# Altium schematic sheet Power Supply Section.SchDoc
size A3; SheetNumber: 2; SheetTotal: 7
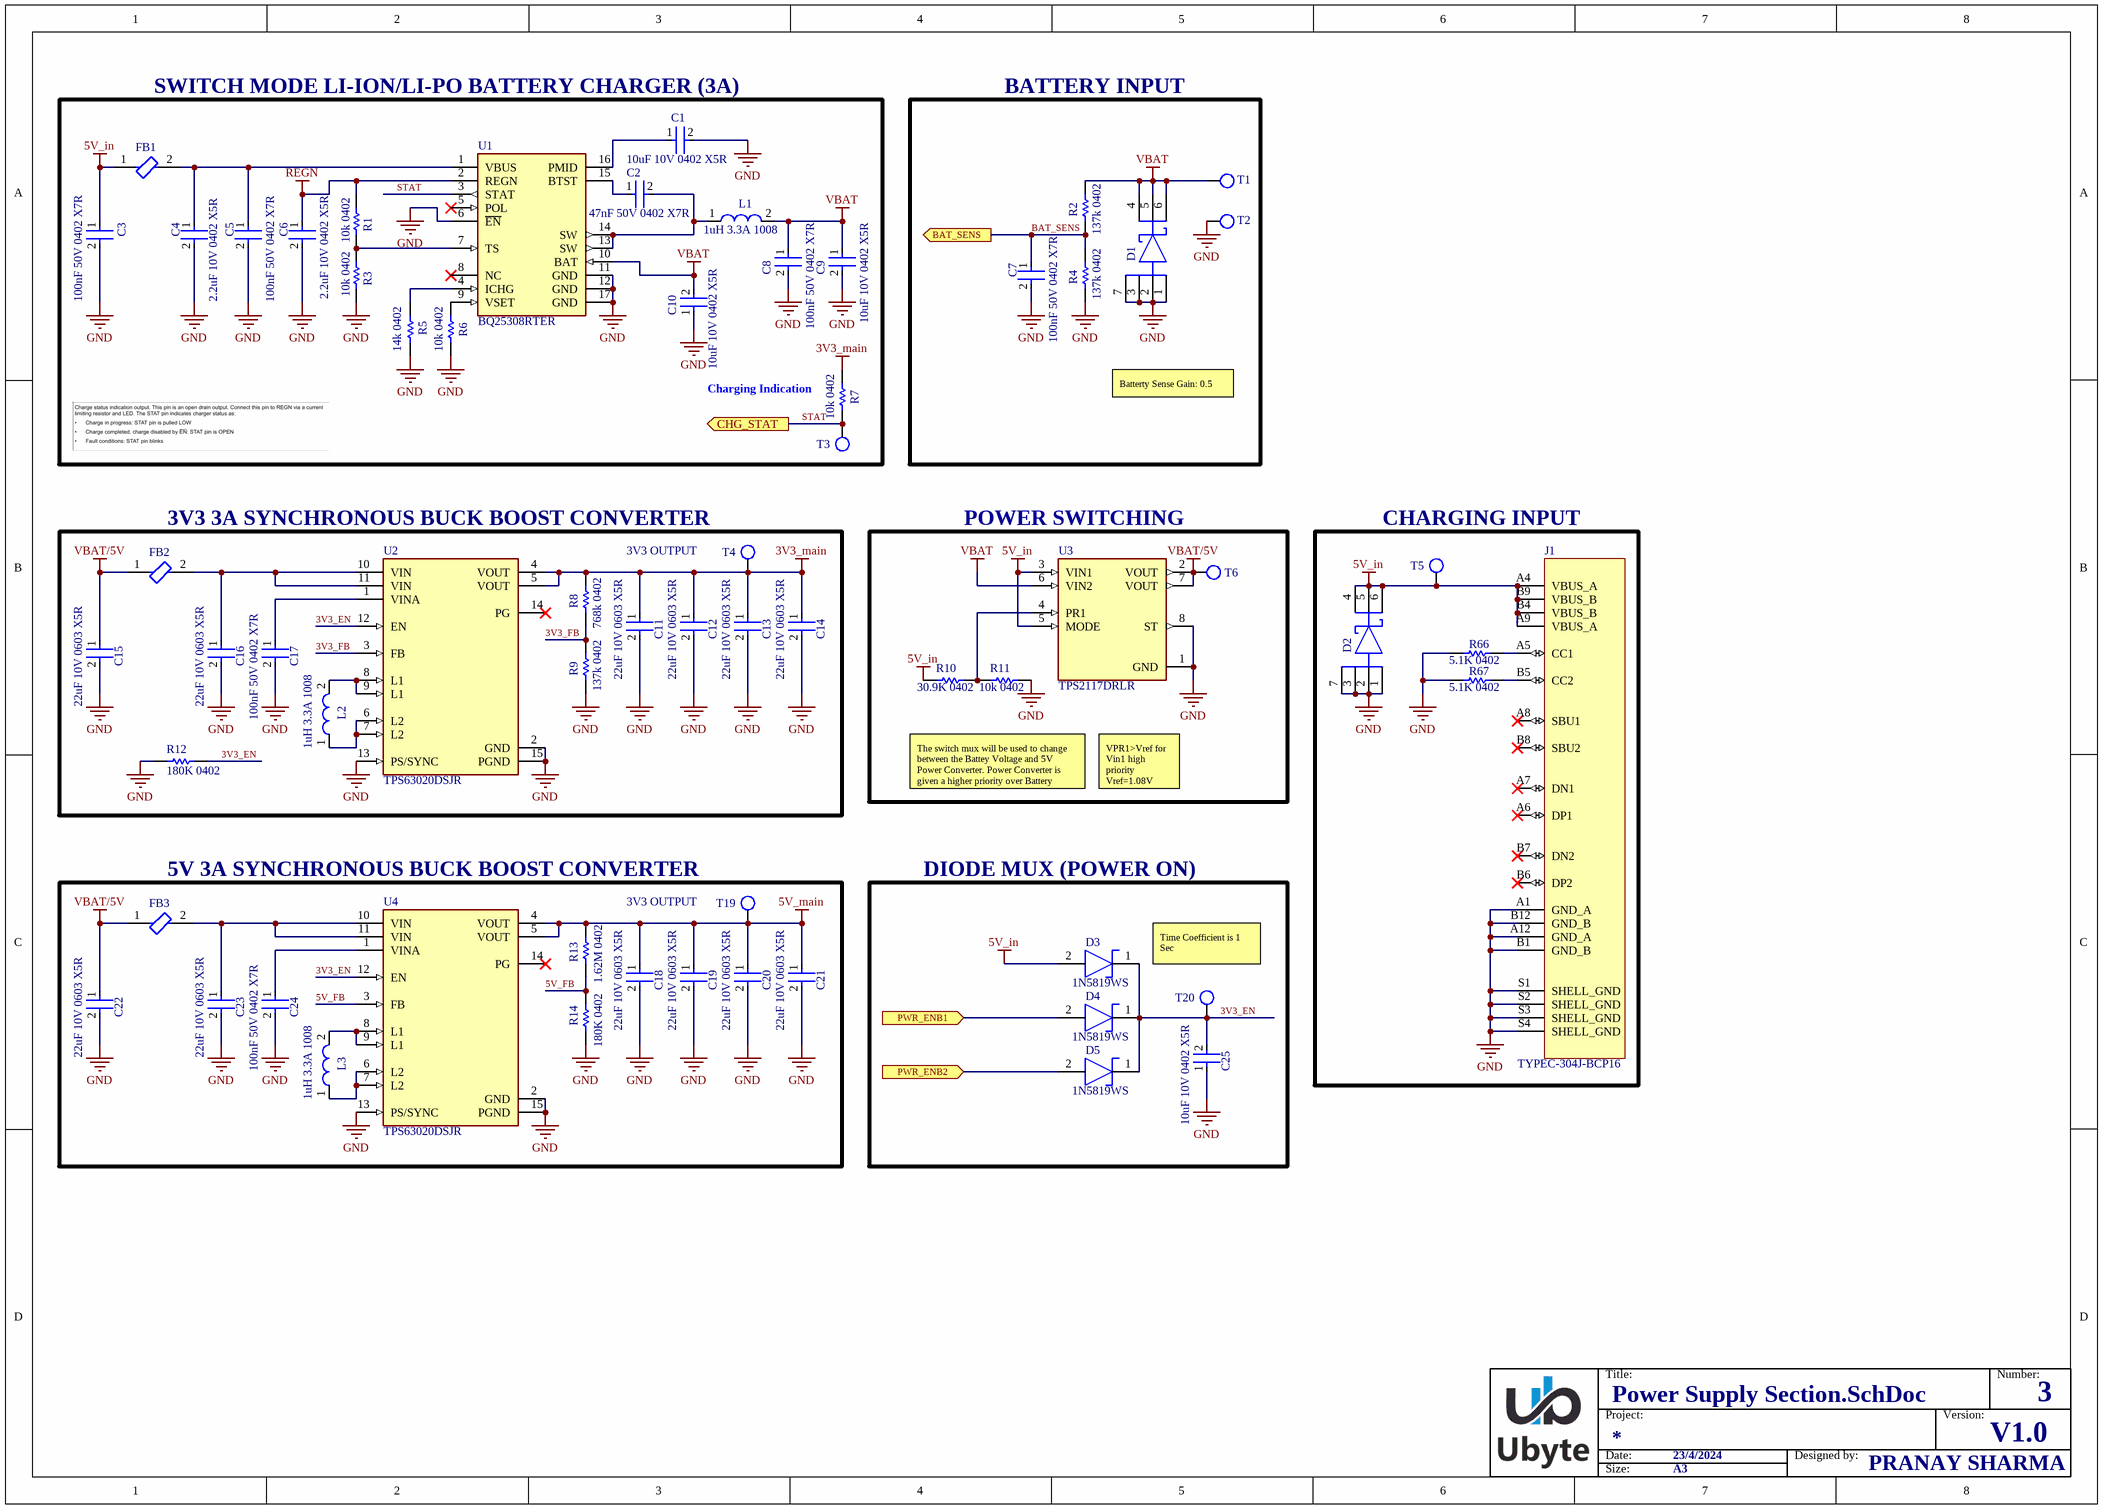
[diagram p0: Power Supply Section.SchDoc]

## Parts
C1  10uF 10V 0402 X5R  [0402 IPC CLASS C CAPACITOR]
C2  47nF 50V 0402 X7R  [0402 IPC CLASS C CAPACITOR]
C3  100nF 50V 0402 X7R  [0402 IPC CLASS C CAPACITOR]
C4  2.2uF 10V 0402 X5R  [0402 IPC CLASS C CAPACITOR]
C5  100nF 50V 0402 X7R  [0402 IPC CLASS C CAPACITOR]
C6  2.2uF 10V 0402 X5R  [0402 IPC CLASS C CAPACITOR]
C7  100nF 50V 0402 X7R  [0402 IPC CLASS C CAPACITOR]
C8  100nF 50V 0402 X7R  [0402 IPC CLASS C CAPACITOR]
C9  10uF 10V 0402 X5R  [0402 IPC CLASS C CAPACITOR]
C10  10uF 10V 0402 X5R  [0402 IPC CLASS C CAPACITOR]
C11  22uF 10V 0603 X5R  [0603 IPC CLASS C CAPACITOR]
C12  22uF 10V 0603 X5R  [0603 IPC CLASS C CAPACITOR]
C13  22uF 10V 0603 X5R  [0603 IPC CLASS C CAPACITOR]
C14  22uF 10V 0603 X5R  [0603 IPC CLASS C CAPACITOR]
C15  22uF 10V 0603 X5R  [0603 IPC CLASS C CAPACITOR]
C16  22uF 10V 0603 X5R  [0603 IPC CLASS C CAPACITOR]
C17  100nF 50V 0402 X7R  [0402 IPC CLASS C CAPACITOR]
C18  22uF 10V 0603 X5R  [0603 IPC CLASS C CAPACITOR]
C19  22uF 10V 0603 X5R  [0603 IPC CLASS C CAPACITOR]
C20  22uF 10V 0603 X5R  [0603 IPC CLASS C CAPACITOR]
C21  22uF 10V 0603 X5R  [0603 IPC CLASS C CAPACITOR]
C22  22uF 10V 0603 X5R  [0603 IPC CLASS C CAPACITOR]
C23  22uF 10V 0603 X5R  [0603 IPC CLASS C CAPACITOR]
C24  100nF 50V 0402 X7R  [0402 IPC CLASS C CAPACITOR]
C25  10uF 10V 0402 X5R  [0402 IPC CLASS C CAPACITOR]
D1  (no value)  [DRV0006A IPC-C]
D2  (no value)  [DRV0006A IPC-C]
D3  1N5819WS  [SOD-323 IPC-C]
D4  1N5819WS  [SOD-323 IPC-C]
D5  1N5819WS  [SOD-323 IPC-C]
FB1  BLM21SP111SN1D  [0603 IPC CLASS C FERRITE BEAD]  (value not drawn)
FB2  BLM21SP111SN1D  [0603 IPC CLASS C FERRITE BEAD]  (value not drawn)
FB3  BLM21SP111SN1D  [0603 IPC CLASS C FERRITE BEAD]  (value not drawn)
J1  TYPEC-304J-BCP16  [VALCON_CSP-USC16-TR]
L1  1uH 3.3A 1008  [1008 Inductor IPC-C]
L2  1uH 3.3A 1008  [1008 Inductor IPC-C]
L3  1uH 3.3A 1008  [1008 Inductor IPC-C]
R1  10k 0402  [0402 IPC CLASS C RESISTOR]
R2  137k 0402  [0402 IPC CLASS C RESISTOR]
R3  10k 0402  [0402 IPC CLASS C RESISTOR]
R4  137k 0402  [0402 IPC CLASS C RESISTOR]
R5  14k 0402  [0402 IPC CLASS C RESISTOR]
R6  10k 0402  [0402 IPC CLASS C RESISTOR]
R7  10k 0402  [0402 IPC CLASS C RESISTOR]
R8  768k 0402  [0402 IPC CLASS C RESISTOR]
R9  137k 0402  [0402 IPC CLASS C RESISTOR]
R10  30.9K 0402  [0402 IPC CLASS C RESISTOR]
R11  10k 0402  [0402 IPC CLASS C RESISTOR]
R12  180K 0402  [0402 IPC CLASS C RESISTOR]
R13  1.62M 0402  [0402 IPC CLASS C RESISTOR]
R14  180K 0402  [0402 IPC CLASS C RESISTOR]
R66  5.1K 0402  [0402 IPC CLASS C RESISTOR]
R67  5.1K 0402  [0402 IPC CLASS C RESISTOR]
T1  Test Point TH  [Test Point TH]  (value not drawn)  (no BOM)
T2  Test Point TH  [Test Point TH]  (value not drawn)  (no BOM)
T3  TP  [Testpoint1]  (value not drawn)  (no BOM)
T4  TP  [Testpoint1]  (value not drawn)  (no BOM)
T5  TP  [Testpoint1]  (value not drawn)  (no BOM)
T6  TP  [Testpoint1]  (value not drawn)  (no BOM)
T19  TP  [Testpoint1]  (value not drawn)  (no BOM)
T20  TP  [Testpoint1]  (value not drawn)  (no BOM)
U1  BQ25308RTER  [RTE0016C IPC-C]
U2  TPS63020DSJR  [FP-DSJ0014A-MFG]
U3  TPS2117DRLR  [DRL0008A IPC-C]
U4  TPS63020DSJR  [FP-DSJ0014A-MFG]

## Blocks framed on the sheet
SWITCH MODE LI-ION/LI-PO BATTERY CHARGER (3A): C1-C6 C8-C10 FB1 L1 R1 R3 R5-R7 T3 U1
BATTERY INPUT: C7 D1 R2 R4 T1 T2
3V3 3A SYNCHRONOUS BUCK BOOST CONVERTER: C11-C17 FB2 L2 R8 R9 R12 T4 U2
POWER SWITCHING: R10 R11 T6 U3
CHARGING INPUT: D2 J1 R66 R67 T5
5V 3A SYNCHRONOUS BUCK BOOST CONVERTER: C18-C24 FB3 L3 R13 R14 T19 U4
DIODE MUX (POWER ON): C25 D3-D5 T20

## Ports
BAT_SENS (out), CHG_STAT (out), PWR_ENB1 (in), PWR_ENB2 (in)

## Nets
3V3_main: C11.1 C12.1 C13.1 C14.1 R7.2 R8.1 T4.0 U2.4(VOUT) U2.5(VOUT)
5V_in: C3.1 D2.4 D2.5 D2.6 D3.2(A) FB1.1 J1.A4(VBUS_A) J1.A9(VBUS_A) J1.B4(VBUS_B) J1.B9(VBUS_B) R10.2 T5.0 U3.3(VIN1) U3.5(MODE)
5V_main: C18.1 C19.1 C20.1 C21.1 R13.2 T19.0 U4.4(VOUT) U4.5(VOUT)
GND: C1.2 C3.2 C4.2 C5.2 C6.2 C7.2 C8.2 C9.2 C10.1 C11.2 C12.2 C13.2 C14.2 C15.2 C16.2 C17.2 C18.2 C19.2 C20.2 C21.2 C22.2 C23.2 C24.2 C25.1 D1.1(C) D1.2(A) D1.3 D1.7 D2.1(C) D2.2(A) D2.3 D2.7 J1.A1(GND_A) J1.A12(GND_A) J1.B1(GND_B) J1.B12(GND_B) J1.S1(SHELL_GND) J1.S2(SHELL_GND) J1.S3(SHELL_GND) J1.S4(SHELL_GND) R3.1 R4.1 R5.1 R6.1 R9.1 R11.1 R12.2 R14.1 R66.1 R67.1 T2.0 U1.6(~{EN}) U1.11(GND) U1.12(GND) U1.17(GND) U2.2(GND) U2.13(PS/SYNC) U2.15(PGND) U3.1(GND) U3.8(ST) U4.2(GND) U4.13(PS/SYNC) U4.15(PGND)
REGN: C6.1 R1.2 U1.2(REGN)
VBAT: C8.1 C9.1 C10.2 D1.4 D1.5 D1.6 L1.2 R2.2 T1.0 U1.10(BAT) U3.6(VIN2)
VBAT/5V: C15.1 C22.1 FB2.1 FB3.1 T6.0 U3.2(VOUT) U3.7(VOUT)
3V3_EN: C25.2 D3.1(C) D4.1(C) D5.1(C) R12.1 T20.0 U2.12(EN) U4.12(EN)
3V3_FB: R8.2 R9.2 U2.3(FB)
5V_FB: R13.1 R14.2 U4.3(FB)
BAT_SENS: C7.1 R2.1 R4.2 ; port BAT_SENS
PWR_ENB1: D4.2(A) ; port PWR_ENB1
PWR_ENB2: D5.2(A) ; port PWR_ENB2
STAT: R7.1 T3.0 U1.3(STAT) ; port CHG_STAT
NetC1_1: C1.1 U1.16(PMID)
NetC2_1: C2.1 U1.15(BTST)
NetC2_2: C2.2 L1.1 U1.13(SW) U1.14(SW)
NetC4_1: C4.1 C5.1 FB1.2 U1.1(VBUS)
NetC16_1: C16.1 FB2.2 U2.10(VIN) U2.11(VIN)
NetC17_1: C17.1 U2.1(VINA)
NetC23_1: C23.1 FB3.2 U4.10(VIN) U4.11(VIN)
NetC24_1: C24.1 U4.1(VINA)
NetJ1_A5: J1.A5(CC1) R66.2
NetJ1_B5: J1.B5(CC2) R67.2
NetL2_1: L2.1 U2.6(L2) U2.7(L2)
NetL2_2: L2.2 U2.8(L1) U2.9(L1)
NetL3_1: L3.1 U4.6(L2) U4.7(L2)
NetL3_2: L3.2 U4.8(L1) U4.9(L1)
NetR1_1: R1.1 R3.2 U1.7(TS)
NetR5_2: R5.2 U1.4(ICHG)
NetR6_2: R6.2 U1.9(VSET)
NetR10_1: R10.1 R11.2 U3.4(PR1)

Not connected (* = marked no-connect by the designer): J1 A6(DP1)* A7(DN1)* A8(SBU1)* B6(DP2)* B7(DN2)* B8(SBU2)*; U1 5(POL)* 8(NC)*; U2 14(PG)*; U4 14(PG)*

## Notes on the sheet
- (near R7) Charging Indication
- Batterty Sense Gain: 0.5
- 3V3 OUTPUT
- The switch mux will be used to change between the Battey Voltage and 5V Power Converter. Power Converter is given a higher priority over Battery
- VPR1>Vref for Vin1 high priority
  Vref=1.08V
- Time Coefficient is 1 Sec
- Title:
- Number:
- Date:
- Project:
- 23/4/2024
- Designed by:
- Version:
- V1.0
- 3
- Size:
- A3
- PRANAY SHARMA

## Library data of the parts
D1 D2 = TVS0500DRVR
J1 = USB Type C
L1-L3 = DFE252012F-1R0M=P2
R1-R4 R6-R9 R11 = 10k 1% 0402
R5 = 14k 1% 0402
R10 = 30.9K 1%  0402
R12 R14 = 180K 1% 0402
R13 = 1.62M 1% 0402
R66 R67 = 5.1K 1% 0402
T3-T6 T19 T20 = Testpoint1
U2 U4 = CMP-2000-07282-2